# Altium schematic sheet CurrentSense.SchDoc
size Letter; Organization: Midnight Sun Solar Rayce Car Team; Address1: University of Waterloo; Address2: 200 University Ave W; Address3: Waterloo, ON, Canada; Address4: N2L 3E9; Website: www.uwmidsun.com
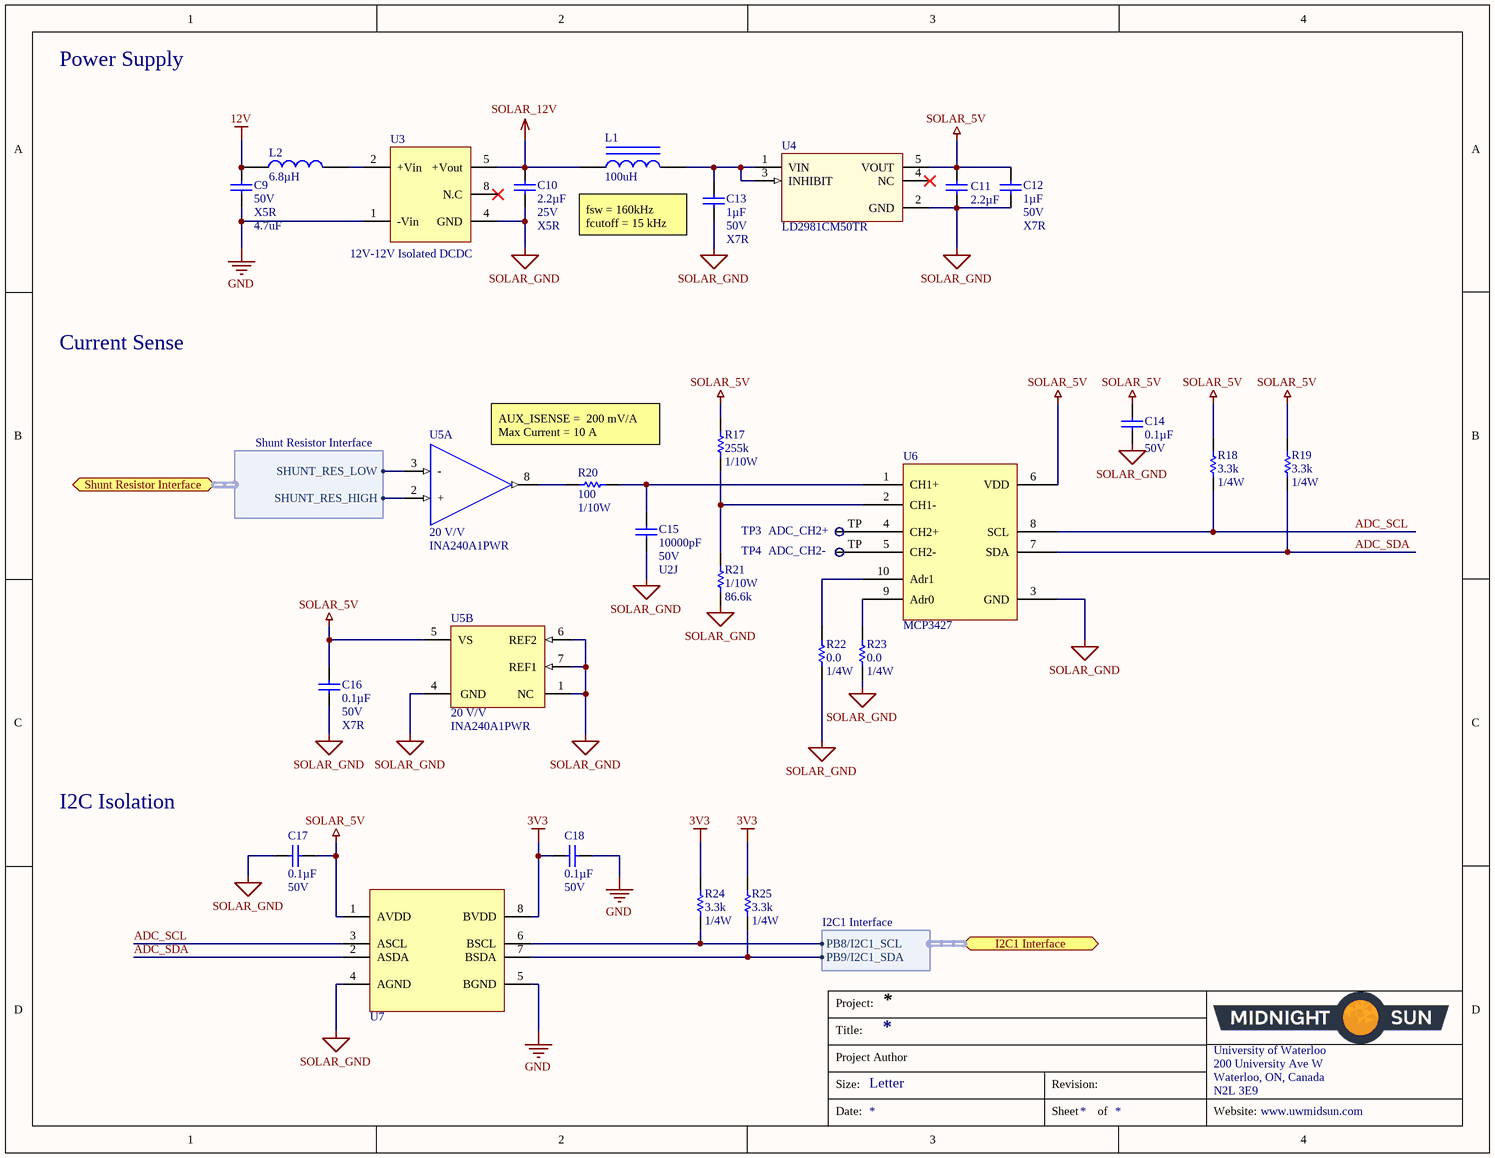
[diagram p0: CurrentSense.SchDoc]

## Parts
C9  value 4.7uF  Voltage - Rated: 50V  Temperature Coefficient: X5R  [CAP, 0805]  (hidden comment: CAP CER 4.7UF 50V 10% X5R 0805)
C10  Capacitance: 2.2µF  Voltage: 25V  Temperature Coefficient: X5R  [CAP, 0603]  (hidden comment: CAP CER 2.2UF 25V 10% X5R 0603)
C11  Capacitance: 2.2µF  [CAP, 0603]  (hidden comment: CAP CER 2.2UF 25V 10% X5R 0603)
C12  Capacitance: 1µF  Voltage: 50V  Temperature Coefficient: X7R  [CAP, 0603]  (hidden comment: CAP CER 1UF 50V 10% X7R 0603)
C13  Capacitance: 1µF  Voltage: 50V  Temperature Coefficient: X7R  [CAP, 0603]  (hidden comment: CAP CER 1UF 50V 10% X7R 0603)
C14  Capacitance: 0.1µF  Voltage: 50V  [CAP, 0603]  (hidden comment: CAP CER 0.1UF 50V 10% X7R 0603)
C15  Capacitance: 10000pF  Voltage: 50V  Temperature Coefficient: U2J  [CAP, 0603]  (hidden comment: CAP CER 10nF 50V 5% X7R 0603)
C16  Capacitance: 0.1µF  Voltage: 50V  Temperature Coefficient: X7R  [CAP, 0603]  (hidden comment: CAP CER 0.1UF 50V 10% X7R 0603)
C17  Capacitance: 0.1µF  Voltage: 50V  [CAP, 0603]  (hidden comment: CAP CER 0.1UF 50V 10% X7R 0603)
C18  Capacitance: 0.1µF  Voltage: 50V  [CAP, 0603]  (hidden comment: CAP CER 0.1UF 50V 10% X7R 0603)
L1  value 100uH  [1210]  (hidden comment: IND 100uH 60mA 5% 1210)
L2  Inductance: 6.8µH  [NLFV32T-6R8M-EF/IND 6.8uH]  (hidden comment: IND 6.8uH 260mA 20% 1210)
R17  Resistance (Ohms): 255k  Power (Watts): 1/10W  [RES, 0603]  (hidden comment: RES 255K OHM 1% 1/10W 0603)
R18  Resistance: 3.3k  Power: 1/4W  [RES, 0603]  (hidden comment: RES 3.3K OHM 1% 1/4W 0603)
R19  Resistance: 3.3k  Power: 1/4W  [RES, 0603]  (hidden comment: RES 3.3K OHM 1% 1/4W 0603)
R20  Resistance: 100  Power: 1/10W  [RES, 0603]  (hidden comment: RES 100 OHM 1% 1/10W 0603)
R21  Power (Watts): 1/10W  Resistance (Ohms): 86.6k  [RES, 0603]  (hidden comment: RES 86.6K OHM 1% 1/10W 0603)
R22  Resistance: 0.0  Power (Watts): 1/4W  [RES, 0603]  (hidden comment: RES 0.0 OHM 1/4W 0603)
R23  Resistance: 0.0  Power (Watts): 1/4W  [RES, 0603]  (hidden comment: RES 0.0 OHM 1/4W 0603)
R24  Resistance: 3.3k  Power: 1/4W  [RES, 0603]  (hidden comment: RES 3.3K OHM 1% 1/4W 0603)
R25  Resistance: 3.3k  Power: 1/4W  [RES, 0603]  (hidden comment: RES 3.3K OHM 1% 1/4W 0603)
TP3  ADC_CH2+  [Test Point]  (no BOM)
TP4  ADC_CH2-  [Test Point]  (no BOM)
U3  Type: 12V-12V Isolated DCDC  [IC, Isolated DCDC]  (hidden comment: IC DCDC ISOLATED 12V 1W 8-SMD 5-LEAD)
U4  Manufacturer Part Number 1: LD2981CM50TR  [SOT95P280X145-5N]  (hidden comment: IC REG LDO 5V 0.1A SOT23-5)
U5  20 V/V  Manufacturer Part Number 1: INA240A1PWR  [IC CURRENT AMPLIFIER INA240 TSSOP-8]  (parts A,B of 2)
U6  Base Part Number: MCP3427  [IC ADC MCP3427]  (hidden comment: IC ADC MCP3427 10MSOP)
U7  IC DGTL ISO I2C 3.75KV 2CH 8SOIC  [IC DGTL ISO 3.75KV I2C 8SOIC NARROW BODY]  (value not drawn)

## Ports
I2C1 Interface (harness I2C1 Interface), Shunt Resistor Interface (harness Shunt Resistor Interface)

## Harnesses
I2C1 Interface: PB8/I2C1_SCL, PB9/I2C1_SDA
Shunt Resistor Interface: SHUNT_RES_LOW, SHUNT_RES_HIGH

## Nets
3V3: C18.1 R24.1 R25.1 U7.8(BVDD)
12V: C9.1 L2.1
GND: C9.2 C18.2 U3.1(-Vin) U7.5(BGND)
SOLAR_5V: C11.1 C12.1 C14.1 C16.1 C17.2 R17.1 R18.1 R19.1 U4.5(VOUT) U5.5(VS) U6.6(VDD) U7.1(AVDD)
SOLAR_12V: C10.1 L1.1 U3.5(+Vout)
SOLAR_GND: C10.2 C11.2 C12.2 C13.2 C14.2 C15.2 C16.2 C17.1 R21.2 R22.2 R23.2 U3.4(GND) U4.2(GND) U5.1(NC) U5.4(GND) U5.6(REF2) U5.7(REF1) U6.3(GND) U7.4(AGND)
ADC_SCL: R18.2 U6.8(SCL) U7.3(ASCL)
ADC_SDA: R19.2 U6.7(SDA) U7.2(ASDA)
NetC13_1: C13.1 L1.2 U4.1(VIN) U4.3(INHIBIT)
NetC15_1: C15.1 R20.2 U6.1(CH1+)
NetL2_2: L2.2 U3.2(+Vin)
NetR17_2: R17.2 R21.1 U6.2(CH1-)
NetR20_1: R20.1 U5.8(OUTPUT)
NetR22_1: R22.1 U6.10(Adr1)
NetR23_1: R23.1 U6.9(Adr0)
NetR24_2: R24.2 U7.6(BSCL) ; port I2C1 Interface.PB8/I2C1_SCL
NetR25_2: R25.2 U7.7(BSDA) ; port I2C1 Interface.PB9/I2C1_SDA
NetTP3_TP: TP3.TP U6.4(CH2+)
NetTP4_TP: TP4.TP U6.5(CH2-)
NetU5_2: U5.2(+) ; port Shunt Resistor Interface.SHUNT_RES_HIGH
NetU5_3: U5.3(-) ; port Shunt Resistor Interface.SHUNT_RES_LOW

Not connected (* = marked no-connect by the designer): U3 8(N.C)*; U4 4(NC)*

## Notes on the sheet
- Power Supply
- fsw = 160kHz
  fcutoff = 15 kHz
- Current Sense
- AUX_ISENSE =  200 mV/A
  Max Current = 10 A
- I2C Isolation
- Project:
- Title:
- Size:
- Project Author
- Letter
- Revision:
- University of Waterloo
- 200 University Ave W
- Waterloo, ON, Canada
- N2L 3E9
- Date:
- Sheet
- of
- Website:

## Library data of the parts
C9 = CAP CER 4.7UF 50V 10% X5R 0805: 4.7µF ±20% 50V Ceramic Capacitor X5R 0805 (2012 Metric); Manufacturer 1: Murata Electronics North America; Manufacturer Part Number 1: GRT21BR61H475ME13L; Description 1: CAP CER 4.7UF 50V X5R 0805; Supplier 1: Digi-Key; Supplier Part Number 1: 490-12395-1-ND; RoHS: RoHS Compliant; Category: Capacitors; Stock 1: 4286; Pricing 1: 1=0.56, 10=0.389, 100=0.2338, 500=0.17536, 1000=0.14808 (CAD); Packaging: Cut Tape (CT); Part Status: Active; Tolerance: ±20%; Operating Temperature: -55°C ~ 85°C; Features: -; Ratings: AEC-Q200; Applications: Automotive; Mounting Type: Surface Mount, MLCC; Package / Case: 0805 (2012 Metric); Size / Dimension: 0.079" L x 0.049" W (2.00mm x 1.25mm); Height - Seated (Max): -; Thickness (Max): 0.057" (1.45mm); Lead Spacing: -; Lead Style: -; ComponentLink1URL: http://search.murata.co.jp/Ceramy/image/img/A01X/G101/ENG/GRT21BR61H475ME13-01.pdf; ComponentLink1Description: http://search.murata.co.jp/Ceramy/image/img/A01X/G101/ENG/GRT21BR61H475ME13-01.pdf
C10 C11 = CAP CER 2.2UF 25V 10% X5R 0603: 2.2µF ±10% 25V Ceramic Capacitor X5R 0603 (1608 Metric); Manufacturer 1: Murata Electronics North America; Manufacturer Part Number 1: GRM188R61E225KA12D; Supplier 1: Digi-Key; Supplier Part Number 1: 490-10731-1-ND; Packaging: Cut Tape (CT); Part Status: Active; Operating Temperature: -55°C ~ 85°C; Ratings: -; Mounting Type: Surface Mount, MLCC; Package / Case: 0603 (1608 Metric); Size / Dimension: 0.063" L x 0.031" W (1.60mm x 0.80mm); Height - Seated (Max): -; Thickness (Max): 0.035" (0.90mm); Lead Spacing: -; Lead Style: -; ComponentLink1URL: http://www.murata.com/~/media/webrenewal/support/library/catalog/products/capacitor/mlcc/c02e.ashx; ComponentLink1Description: http://www.murata.com/~/media/webrenewal/support/library/catalog/products/capacitor/mlcc/c02e.ashx; Tolerance: ±10%
  C11: Voltage: 25V; Temperature Coefficient: X5R
C12 C13 = CAP CER 1UF 50V 10% X7R 0603: 1µF ±10% 50V Ceramic Capacitor X7R 0603 (1608 Metric); Manufacturer 1: Taiyo Yuden; Manufacturer Part Number 1: UMK107AB7105KA-T; Supplier 1: Digi-Key; Supplier Part Number 1: 587-3247-1-ND; Packaging: Cut Tape (CT); Part Status: Active; Operating Temperature: -55°C ~ 125°C; Ratings: -; Mounting Type: Surface Mount, MLCC; Package / Case: 0603 (1608 Metric); Size / Dimension: 0.063" L x 0.031" W (1.60mm x 0.80mm); Height - Seated (Max): -; Thickness (Max): 0.037" (0.95mm); Lead Spacing: -; Lead Style: -; ComponentLink1URL: http://www.yuden.co.jp/productdata/catalog/en/mlcc_all_e.pdf; ComponentLink1Description: http://www.yuden.co.jp/productdata/catalog/en/mlcc_all_e.pdf; Tolerance: ±10%
C14 C16-C18 = CAP CER 0.1UF 50V 10% X7R 0603: 0.10µF ±10% 50V Ceramic Capacitor X7R 0603 (1608 Metric); Manufacturer 1: AVX Corporation; Manufacturer Part Number 1: 06035C104KAT2A; Supplier 1: Digi-Key; Supplier Part Number 1: 478-5052-1-ND; Packaging: Cut Tape (CT); Part Status: Active; Operating Temperature: -55°C ~ 125°C; Ratings: -; Mounting Type: Surface Mount, MLCC; Package / Case: 0603 (1608 Metric); Size / Dimension: 0.063" L x 0.032" W (1.60mm x 0.81mm); Height - Seated (Max): -; Thickness (Max): 0.035" (0.90mm); Lead Spacing: -; Lead Style: -; ComponentLink1URL: http://datasheets.avx.com/X7RDielectric.pdf; ComponentLink1Description: http://datasheets.avx.com/X7RDielectric.pdf; Tolerance: ±10%
  C14 C17 C18: Temperature Coefficient: X7R
C15 = CAP CER 10nF 50V 5% X7R 0603: 10000pF ±5% 50V Ceramic Capacitor U2J 0603 (1608 Metric); Manufacturer 1: KEMET; Manufacturer Part Number 1: C0603C103J5JAC7867; Supplier 1: Digi-Key; Supplier Part Number 1: 399-13384-1-ND; Packaging: Cut Tape (CT); Part Status: Active; Operating Temperature: -55°C ~ 125°C; Ratings: -; Failure Rate: -; Mounting Type: Surface Mount, MLCC; Package / Case: 0603 (1608 Metric); Size / Dimension: 0.063" L x 0.032" W (1.60mm x 0.80mm); Height - Seated (Max): -; Thickness (Max): 0.034" (0.87mm); Lead Spacing: -; Lead Style: -; ComponentLink1URL: http://www.kemet.com/docfinder?Partnumber=C0603C103J5JAC7867; ComponentLink1Description: http://www.kemet.com/docfinder?Partnumber=C0603C103J5JAC7867; Tolerance: ±5%
L1 = IND 100uH 60mA 5% 1210: 100µH Unshielded Wirewound Inductor 60mA 11 Ohm Max 1210 (3225 Metric); Manufacturer: EPCOS (TDK); Manufacturer Part Number: B82422T1104J000; Material - Core: Ferrite; Q @ Freq: 20 @ 796kHz; Supplier 1: Digi-Key; RoHS: RoHS Compliant; Category: Inductors, Coils, Chokes; Stock 1: 4846; Pricing 1: 1=0.65, 10=0.568, 100=0.4062, 500=0.3412, 1000=0.27621 (CAD); Packaging: Cut Tape (CT); Part Status: Active; Type: Wirewound; Tolerance: ±5%; Shielding: Unshielded; DC Resistance (DCR): 11 Ohm Max; Ratings: AEC-Q200; Operating Temperature: -55°C ~ 125°C; Mounting Type: Surface Mount; Package / Case: 1210 (3225 Metric); Supplier Device Package: 1210 (3225 Metric); Size / Dimension: 0.126" L x 0.098" W (3.20mm x 2.50mm); Height - Seated (Max): 0.083" (2.10mm); ComponentLink1URL: https://en.tdk.eu/inf/30/db/ind_2008/b82422t.pdf; ComponentLink1Description: https://en.tdk.eu/inf/30/db/ind_2008/b82422t.pdf; Supplier Part Number 1: 495-5646-1-ND
L2 = IND 6.8uH 260mA 20% 1210: 6.8µH Shielded Wirewound Inductor 260mA 204 mOhm Max 1210 (3225 Metric); Manufacturer 1: TDK Corporation; Manufacturer Part Number 1: NLFV32T-6R8M-EF; Material - Core: Ferrite; Supplier 1: Digi-Key; Supplier Part Number 1: 445-15776-1-ND; Packaging: Cut Tape (CT); Part Status: Active; Type: Wirewound; Current Rating: 260mA; Current - Saturation: -; Shielding: Shielded; DC Resistance (DCR): 204 mOhm Max; Q @ Freq: -; Frequency - Self Resonant: -; Ratings: -; Operating Temperature: -40°C ~ 105°C; Mounting Type: Surface Mount; Package / Case: 1210 (3225 Metric); Supplier Device Package: 1210 (3225 Metric); Size / Dimension: 0.126" L x 0.098" W (3.20mm x 2.50mm); Height - Seated (Max): 0.094" (2.40mm); ComponentLink1URL: https://product.tdk.com/info/en/catalog/datasheets/inductor_commercial_decoupling_nlfv32-ef_en.pdf; ComponentLink1Description: https://product.tdk.com/info/en/catalog/datasheets/inductor_commercial_decoupling_nlfv32-ef_en.pdf; Tolerance: ±20%
R17 = RES 255K OHM 1% 1/10W 0603: 255k Ohm ±1% 0.1W, 1/10W Chip Resistor 0603 (1608 Metric) Moisture Resistant Thick Film; Manufacturer 1: Yageo; Manufacturer Part Number 1: RC0603FR-07255KL; Description 1: RES SMD 255K OHM 1% 1/10W 0603; Temperature Coefficient: ±100ppm/°C; Supplier 1: Digi-Key; Supplier Part Number 1: 311-255KHRCT-ND; RoHS: RoHS Compliant; Category: Resistors; Stock 1: 106564; Pricing 1: 1=0.16, 10=0.022, 100=0.0089, 1000=0.00402, 2500=0.00349 (CAD); Packaging: Cut Tape (CT); Part Status: Active; Composition: Thick Film; Features: Moisture Resistant; Operating Temperature: -55°C ~ 155°C; Package / Case: 0603 (1608 Metric); Supplier Device Package: 0603; Size / Dimension: 0.063" L x 0.031" W (1.60mm x 0.80mm); Height - Seated (Max): 0.022" (0.55mm); Failure Rate: -; ComponentLink1URL: http://www.yageo.com/documents/recent/PYu-RC_Group_51_RoHS_L_7.pdf; ComponentLink1Description: http://www.yageo.com/documents/recent/PYu-RC_Group_51_RoHS_L_7.pdf; Tolerance: ±1%
R18 R19 R24 R25 = RES 3.3K OHM 1% 1/4W 0603: 3.3k Ohm ±1% 0.25W, 1/4W Chip Resistor 0603 (1608 Metric) Automotive AEC-Q200, Pulse Withstanding Thick Film; Manufacturer 1: Panasonic Electronic Components; Manufacturer Part Number 1: ERJ-PA3F3301V; Temperature Coefficient: ±100ppm/°C; Supplier 1: Digi-Key; Supplier Part Number 1: P3.3KBYCT-ND; Packaging: Cut Tape (CT); Part Status: Active; Composition: Thick Film; Operating Temperature: -55°C ~ 155°C; Package / Case: 0603 (1608 Metric); Supplier Device Package: 0603; Size / Dimension: 0.063" L x 0.031" W (1.60mm x 0.80mm); Height - Seated (Max): 0.022" (0.55mm); Failure Rate: -; ComponentLink1URL: https://industrial.panasonic.com/cdbs/www-data/pdf/RDO0000/AOA0000C291.pdf; ComponentLink1Description: https://industrial.panasonic.com/cdbs/www-data/pdf/RDO0000/AOA0000C291.pdf; Tolerance: ±1%
R20 = RES 100 OHM 1% 1/10W 0603: 100 Ohm ±1% 0.1W, 1/10W Chip Resistor 0603 (1608 Metric) Moisture Resistant Thick Film; Manufacturer 1: Yageo; Manufacturer Part Number 1: RC0603FR-07100RL; Temperature Coefficient: ±100ppm/°C; Supplier 1: Digi-Key; Supplier Part Number 1: 311-100HRCT-ND; Packaging: Cut Tape (CT); Part Status: Active; Composition: Thick Film; Operating Temperature: -55°C ~ 155°C; Package / Case: 0603 (1608 Metric); Supplier Device Package: 0603; Size / Dimension: 0.063" L x 0.031" W (1.60mm x 0.80mm); Height - Seated (Max): 0.022" (0.55mm); Failure Rate: -; ComponentLink1URL: http://www.yageo.com/documents/recent/PYu-RC_Group_51_RoHS_L_7.pdf; ComponentLink1Description: http://www.yageo.com/documents/recent/PYu-RC_Group_51_RoHS_L_7.pdf; Tolerance: ±1%
R21 = RES 86.6K OHM 1% 1/10W 0603: 86.6k Ohm ±1% 0.1W, 1/10W Chip Resistor 0603 (1608 Metric) Automotive AEC-Q200 Thick Film; Manufacturer: Panasonic Electronic Components; Manufacturer Part Number: ERJ-3EKF8662V; Temperature Coefficient: ±100ppm/°C; Supplier 1: Digi-Key; RoHS: RoHS Compliant; Category: Resistors; Stock 1: 64161; Pricing 1: 1=0.16, 10=0.031, 100=0.0127, 1000=0.00567, 2500=0.00492 (CAD); Packaging: Cut Tape (CT); Part Status: Active; Composition: Thick Film; Features: Automotive AEC-Q200; Operating Temperature: -55°C ~ 155°C; Package / Case: 0603 (1608 Metric); Supplier Device Package: 0603; Size / Dimension: 0.063" L x 0.031" W (1.60mm x 0.80mm); Height - Seated (Max): 0.022" (0.55mm); Failure Rate: -; ComponentLink1URL: https://industrial.panasonic.com/cdbs/www-data/pdf/RDA0000/AOA0000C298.pdf; ComponentLink1Description: https://industrial.panasonic.com/cdbs/www-data/pdf/RDA0000/AOA0000C298.pdf; Supplier Part Number 1: P86.6KHCT-ND; Tolerance: ±1%
R22 R23 = RES 0.0 OHM 1/4W 0603: RES SMD 0.0 OHM JUMPER 1/4W 0603; Manufacturer 1: Vishay Dale; Manufacturer Part Number 1: CRCW06030000Z0EAHP; Supplier 1: Digi-Key; Supplier Part Number 1: 541-0.0SBCT-ND; Packaging: Cut Tape (CT); Part Status: Active; Composition: Thick Film; Operating Temperature: -55°C ~ 155°C; Package / Case: 0603 (1608 Metric); Supplier Device Package: 0603; Size / Dimension: 0.063" L x 0.033" W (1.60mm x 0.85mm); Height - Seated (Max): 0.022" (0.55mm); Failure Rate: -; ComponentLink1URL: http://www.vishay.com/docs/20043/crcwhpe3.pdf; ComponentLink1Description: http://www.vishay.com/docs/20043/crcwhpe3.pdf
TP3 TP4 = Test Point
U3 = IC DCDC ISOLATED 12V 1W 8-SMD 5-LEAD: Isolated Module DC DC Converter 1 Output 12V 84mA 10.8V - 13.2V Input; Manufacturer 1: XP Power; Manufacturer Part Number 1: ISE1212A; Number of Outputs: 1; Voltage - Isolation: 1.5kV (1500V); Efficiency: 81%; Supplier 1: Digi-Key; Supplier Part Number 1: 1470-2950-1-ND; Packaging: Cut Tape (CT); Part Status: Active; Voltage - Input (Min): 10.8V; Voltage - Input (Max): 13.2V; Voltage - Output 1: 12V; Voltage - Output 2: -; Voltage - Output 3: -; Current - Output (Max): 84mA; Operating Temperature: -40°C ~ 105°C; Mounting Type: Surface Mount; Package / Case: 8-SMD Module, 5 Leads; Size / Dimension: 0.50" L x 0.44" W x 0.29" H (12.7mm x 11.2mm x 7.3mm); ComponentLink1URL: http://www.xppower.com/Portals/0/pdfs/SF_ISE.pdf; ComponentLink1Description: http://www.xppower.com/Portals/0/pdfs/SF_ISE.pdf; Power: 1W
U4 = IC REG LDO 5V 0.1A SOT23-5: Linear Voltage Regulator IC Positive Fixed Output 5V 100mA SOT-23-5; Manufacturer 1: STMicroelectronics; Voltage - Dropout (Typical): 0.18V @ 100mA; Voltage - Input: Up to 16V; Supplier 1: Digi-Key; Supplier Part Number 1: 497-7787-1-ND; Packaging: Cut Tape (CT); Part Status: Active; Regulator Topology: Positive Fixed; Voltage - Output: 5V; Current - Output: 100mA; Current - Limit (Min): -; Operating Temperature: -40°C ~ 125°C; Mounting Type: Surface Mount; Package / Case: SC-74A, SOT-753; Supplier Device Package: SOT-23-5; ComponentLink1URL: http://www.st.com/content/ccc/resource/technical/document/datasheet/group1/b7/b5/a1/83/9c/bd/4a/90/CD00001635/files/CD00001635.pdf/jcr:content/translations/en.CD00001635.pdf; ComponentLink1Description: http://www.st.com/content/ccc/resource/technical/document/datasheet/group1/b7/b5/a1/83/9c/bd/4a/90/CD00001635/files/CD00001635.pdf/jcr:content/translations/en.CD00001635.pdf
U5 = IC CURRENT AMPLIFIER INA240A1 20V/V 8-TSSOP: Current Sense Amplifier 1 Circuit 8-TSSOP; Manufacturer 1: Texas Instruments; ComponentLink1URL: http://www.ti.com/lit/ds/symlink/ina240.pdf; ComponentLink1Description: http://www.ti.com/lit/ds/symlink/ina240.pdf; Supplier 1: Digi-Key; Supplier Part Number 1: 296-45088-1-ND; Stock 1: 4306; Pricing 1: 1=2.65, 10=2.377, 100=1.9109, 500=1.56998, 1000=1.30084 (USD); Case/Package: TSSOP; Min Operating Temperature: -40°C; Max Operating Temperature: 125°C; Lead Free: Lead Free
U6 = IC ADC MCP3427 10MSOP: 16 Bit Analog to Digital Converter 2 Input 1 Sigma-Delta 10-MSOP; Manufacturer: Microchip Technology; Manufacturer Part Number: MCP3427-E/UN; Number of Bits: 16; Sampling Rate (Per Second): 15; Number of Inputs: 2; Input Type: Differential; Data Interface: I²C; Configuration: MUX-PGA-ADC; Reference Type: Internal; Voltage - Supply, Analog: 2.7 V ~ 5.5 V; Supplier 1: Digi-Key; RoHS: RoHS Compliant; Category: Integrated Circuits (ICs); Stock 1: 3001; Pricing 1: 1=4.32, 25=3.6064, 100=3.2704 (CAD); Packaging: Tube; Part Status: Active; Ratio - S/H:ADC: -; Architecture: Sigma-Delta; Voltage - Supply, Digital: 2.7 V ~ 5.5 V; Features: PGA, Selectable Address; Operating Temperature: -40°C ~ 125°C; Package / Case: 10-TFSOP, 10-MSOP (0.118", 3.00mm Width); Supplier Device Package: 10-MSOP; ComponentLink1URL: http://www.microchip.com/mymicrochip/filehandler.aspx?ddocname=en546216; ComponentLink1Description: http://www.microchip.com/mymicrochip/filehandler.aspx?ddocname=en546216; Supplier Part Number 1: MCP3427-E/UN-ND
U7 = IC DGTL ISO I2C 3.75KV 2CH 8SOIC: I²C Digital Isolator 3750Vrms 2 Channel 35kV/µs CMTI 8-SOIC (0.154", 3.90mm Width); Manufacturer 1: Silicon Labs; Manufacturer Part Number 1: SI8600AC-B-ISR; Number of Channels: 2; Data Rate: 10Mbps; Propagation Delay: 26ns; Channel Type: Bidirectional; Isolated Power: No; Pulse Width Distortion (PWD): 32ns; Supplier 1: Digi-Key; Supplier Part Number 1: SI8600AC-B-ISRCT-ND; Stock 1: 4033; Pricing 1: 1=3.33, 25=3.2084, 100=3.0849 (USD); Case/Package: SOIC; Number of Pins: 8; Weight: 0.006596oz; Min Operating Temperature: -40°C; Max Operating Temperature: 125°C; Package Quantity: 2500; Packaging: Tape and Reel; Polarity: Bidirectional; ComponentLink1URL: https://datasheet.ciiva.com/14921/supportdocuments2ftechnicaldocs2fsi860x-14921653.pdf; ComponentLink1Description: https://datasheet.ciiva.com/14921/supportdocuments2ftechnicaldocs2fsi860x-14921653.pdf